# EasyEDA schematic 1-Schematic_SMUC2.json
TITLE: SMUC v2; REV: 1.0.1; Date: 2022-08-15; Sheet: 1/1; Drawn By: Romych; Company: zx-pk.ru
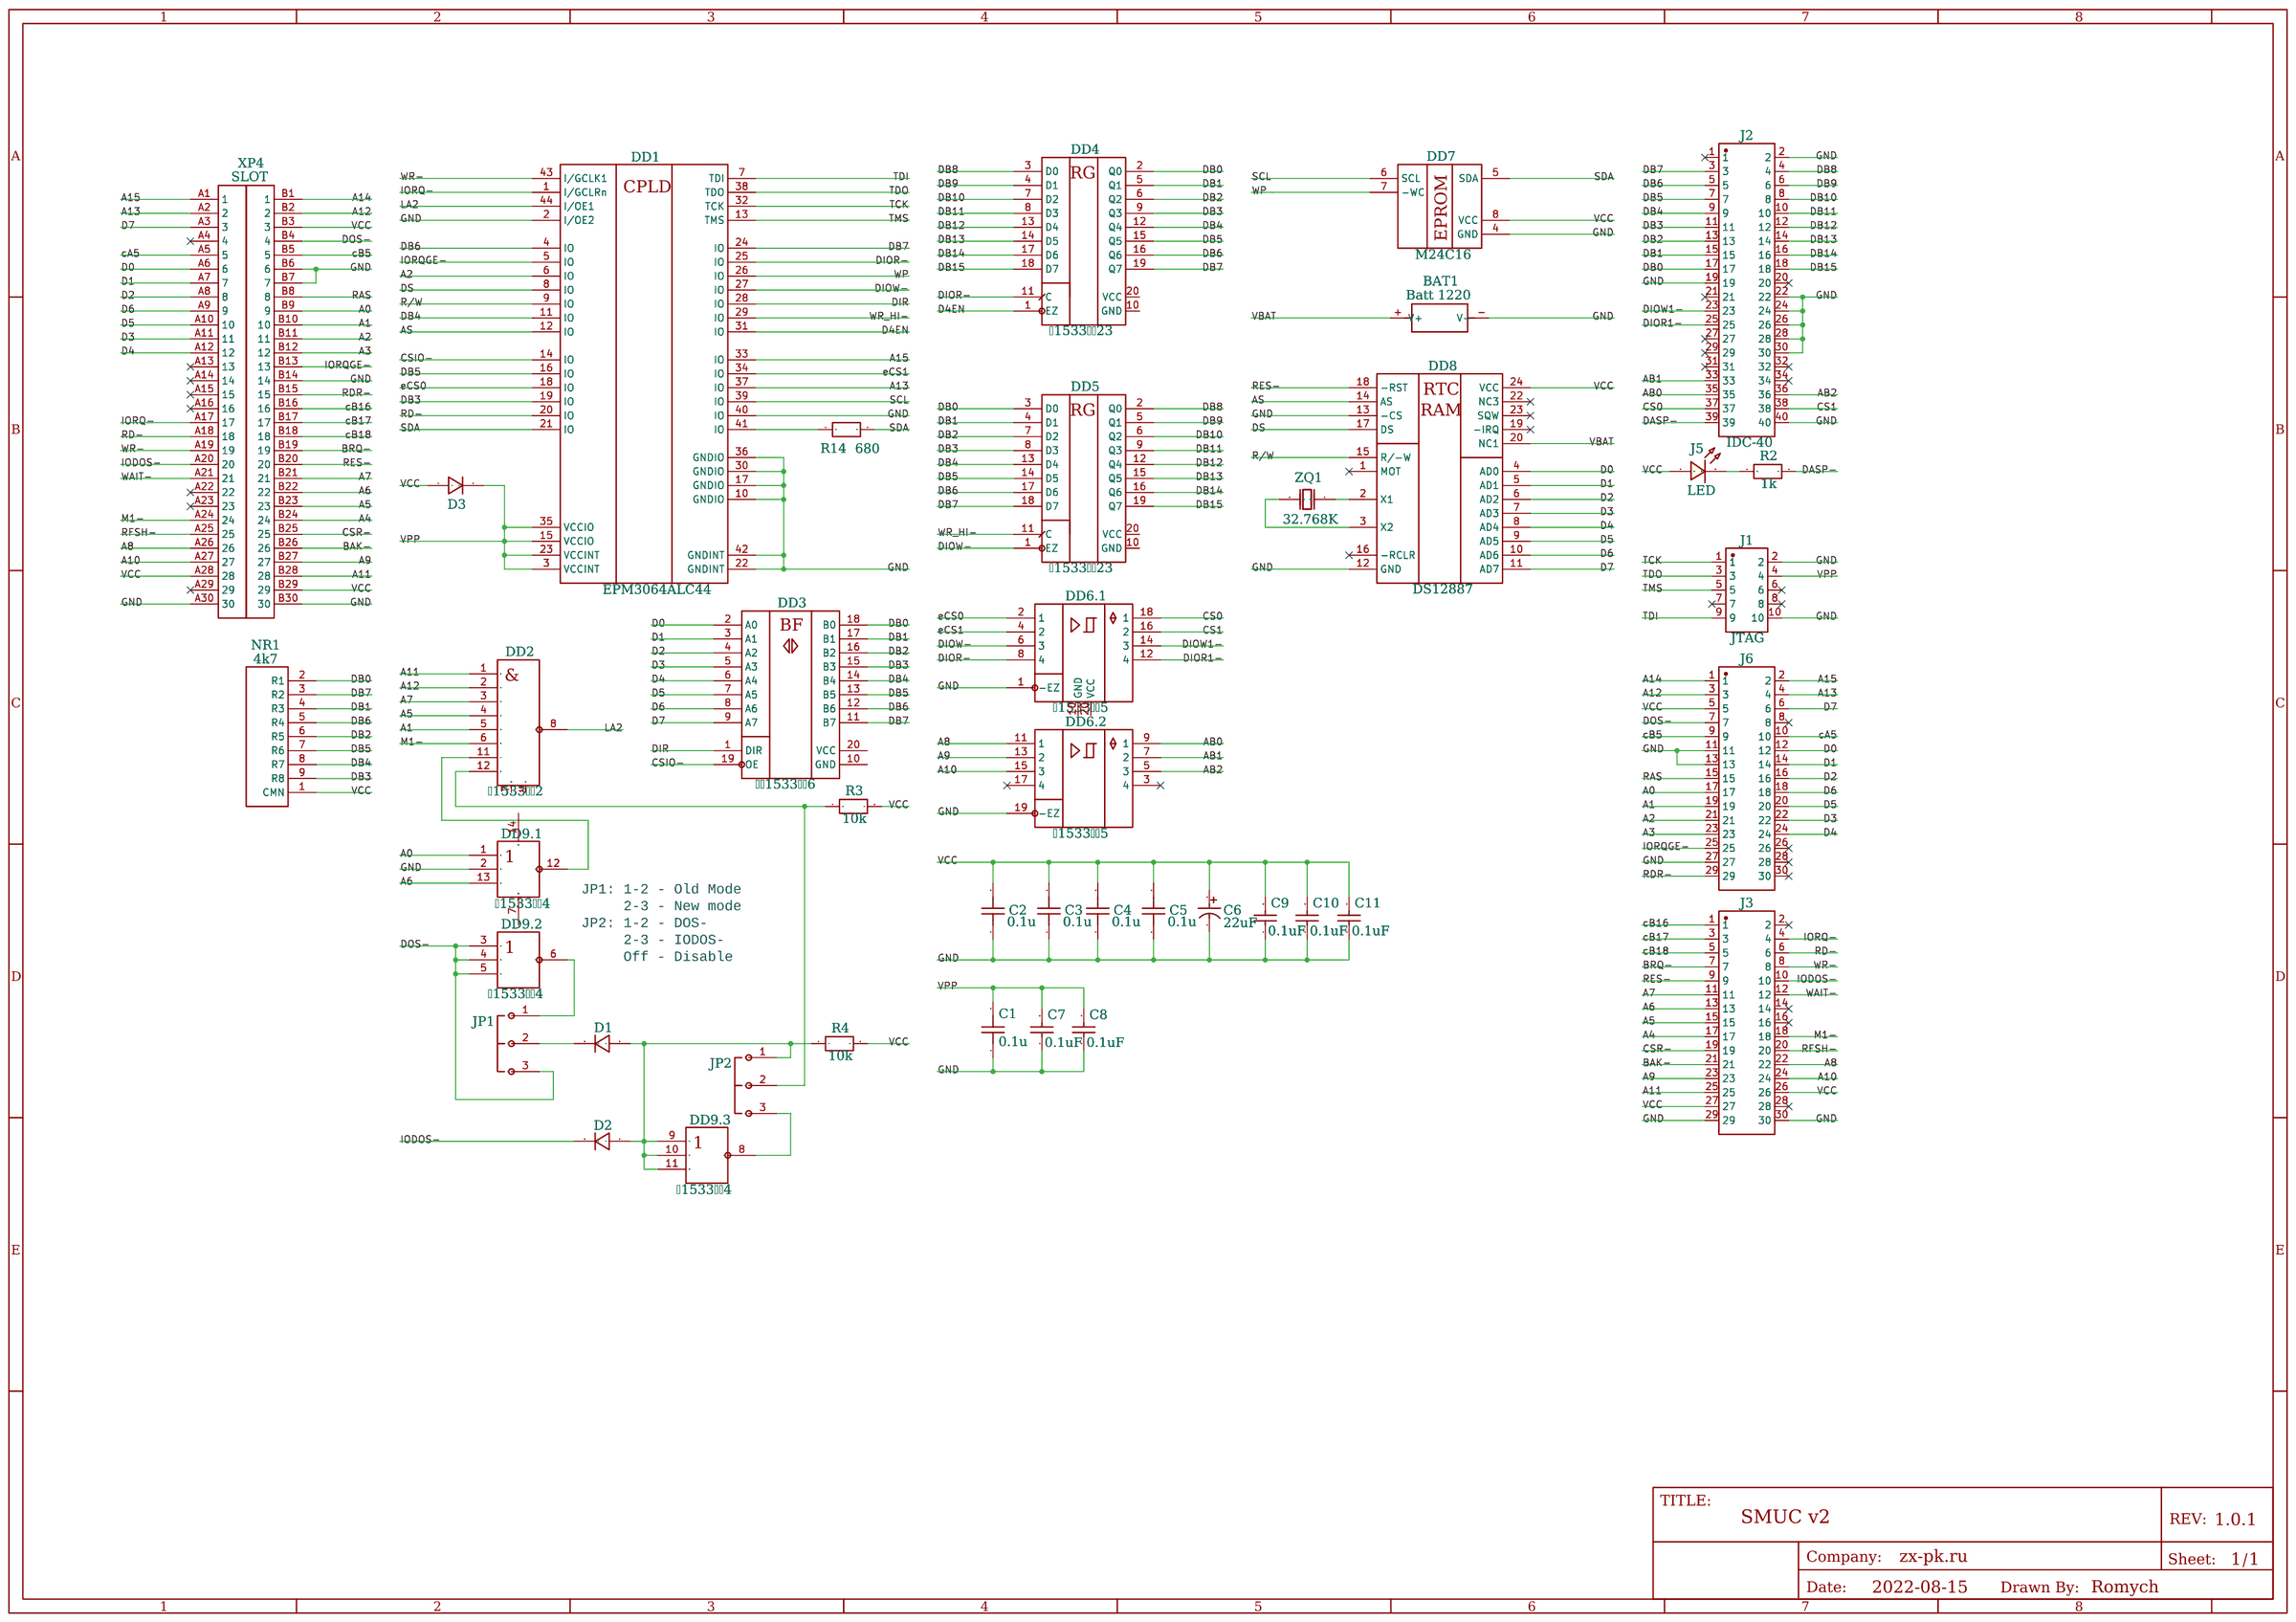
[diagram p0: schematic sheet]

## Parts
BAT1  Batt 1220  [BAT2P-SMD-16.4-CR1220]
C1  0.1u  [CAP-TH_L5.08]
C2  0.1u  [CAP-TH_L5.08]
C3  0.1u  [CAP-TH_L5.08]
C4  0.1u  [CAP-TH_L5.08]
C5  0.1u  [CAP-TH_L5.08]
C6  22uF  [CAP-TH_BD6.3-P2.50-D1.0-FD]
C7  0.1uF  [C0805]
C8  0.1uF  [C0805]
C9  0.1uF  [C0805]
C10  0.1uF  [C0805]
C11  0.1uF  [C0805]
D1  1N4148  [DIODE-TH_10.16]
D2  1N4148  [DIODE-TH_10.16]
D3  1N4148  [DIODE-TH_10.16]
DD1  EPM3064ALC44  [PLCC-44_TH_STD]
DD2  К1533ЛА2  [DIP-14_STD]
DD3  КР1533АП6  [DIP-20_STD]
DD4  К1533ИР23  [DIP-20_STD]
DD5  К1533ИР23  [DIP-20_STD]
DD6  К1533АП5  [DIP-20_STD]  (sections 1,2)
DD7  M24C16  [DIP-8_STD]
DD8  DS12887  [DIP-24_STD]
DD9  К1533ЛЕ4  [DIP-14_STD]  (sections 1,2,3)
J1  JTAG  [IDC-TH_10P-P2.54-V-R2-C5-S2.54]
J2  IDC-40  [CONN-TH_40P-P2.54_MTFD10-40B1]
J3  PM254-2-15-Z-8.5  [HDR-TH_30P-P2.54-V-F-R2-C15-S2.54-2]
J5  LED  [D-TH_L2.54]
J6  PM254-2-15-Z-8.5  [HDR-TH_30P-P2.54-V-F-R2-C15-S2.54-2]
JP1  Old/New  [HDR-TH_3P-P2.54-V-M]
JP2  DOS/IODOS  [HDR-TH_3P-P2.54-V-M]
NR1  4k7  [HDR-TH_9P-P2.54-V-F]
R2  1k  [R_0.125_7.62]
R3  10k  [R_0.125_7.62]
R4  10k  [R_0.125_7.62]
R14  680  [R_0.125_V_TH]
XP4  SLOT  [SL60-SLOT-2.54]
ZQ1  32.768K  [OSC-TH_5.08_H]

## Library data of the parts
BAT1 = SMD Battery Cell Holder Plastic: Manufacturer Part: ?
C1-C5 = CK45-R3AD152K-VRY: Supplier: LCSC; Supplier Part: C340608; Manufacturer: TDK; Contributor: LCSC
C6 = ECLJ0612220M101P00: Supplier: LCSC; Supplier Part: C156809; Manufacturer: Guangdong TOPAZ Elec Tech; Contributor: LCSC
C7-C11 = 0805CG0R5C500NT: Supplier: LCSC; Manufacturer: FH; Supplier Part: C1784
D1-D3 = 1N4148: Contributor: EasyEDA
DD1 = EPM3064ALC44: Contributor: romychs_4693
DD2 = К1533ЛА2: Supplier: chipdip; Contributor: Roman Boykov
DD3 = КР1533АП6: Supplier: chipdip; Contributor: romychs_4693
DD4 DD5 = К1533ИР23: Supplier: chipdip; link: TTL; Регистр; ИР23; Contributor: romychs_4693
DD6 = К1533АП5: Contributor: romychs_4693; subpart_no: 1
DD7 = M24C16: Contributor: Roman Boykov
DD8 = DS12887: Contributor: romychs_4693
DD9 = К1533ЛЕ4: Supplier: chipdip; Contributor: Roman Boykov; subpart_no: 1
J1 = X6521FV-2×05-C85D32: Supplier: LCSC; Supplier Part: C718231; Manufacturer: XKB Connectivity; Contributor: LCSC
J2 = MTFD10-40B1: Supplier: LCSC; Supplier Part: C376159; Manufacturer: MINTRON; Contributor: LCSC
J3 J6 = PM254-2-15-Z-8.5: Supplier: LCSC; Supplier Part: C2897416; Manufacturer: HCTL(华灿天禄); Contributor: LCSC; JLCPCB Part Class: Extended Part
J5 = LED-0603_R: Manufacturer: EVERLIGHT(台湾亿光); Manufacturer Part: 19-217/R6C-AL1M2VY/3T; Supplier Part: C72044; Supplier: LCSC; Contributor: LCEDA_01
JP1 JP2 = JUMPER-3PM-H: Contributor: romychs_4693
NR1 = НР-8: Supplier: chipdip; Contributor: Roman Boykov
R2-R4 R14 = RN 1/8W 470R F T/B A1: Supplier: LCSC; Supplier Part: C433478; Manufacturer: TyoHM; Contributor: LCSC
XP4 = PinHeader_2x30: Contributor: Roman Boykov
ZQ1 = CFS-20632768EZFB: Supplier: LCSC; Supplier Part: C326534; Manufacturer: CITIZEN; Contributor: LCSC

## Nets
GND: BAT1.-(V-) C1.1 C2.1 C3.1 C4.1 C5.1 C6.2 C7.1 C8.1 C9.1 C10.1 C11.1 DD1.2(I/OE2) DD1.10(GNDIO) DD1.17(GNDIO) DD1.22(GNDINT) DD1.30(GNDIO) DD1.36(GNDIO) DD1.40(IO) DD1.42(GNDINT) DD6.1(-EZ) DD6.19(-EZ) DD7.4(GND) DD8.12(GND) DD8.13(-CS) DD9.2(I2) J1.2 J1.10 J2.2 J2.19 J2.22 J2.24 J2.26 J2.28 J2.30 J2.40 J3.29 J3.30 J6.11 J6.13 J6.27 XP4.A30(30) XP4.B6(6) XP4.B7(7) XP4.B14(14) XP4.B30(30)
VBAT: BAT1.+(V+) DD8.20(NC1)
VCC: C2.2 C3.2 C4.2 C5.2 C6.1 C9.2 C10.2 C11.2 D3.1(A) DD7.8(VCC) DD8.24(VCC) J3.26 J3.27 J5.1 J6.5 NR1.1(CMN) R3.2 R4.2 XP4.A28(28) XP4.B3(3) XP4.B29(29)
A0: DD9.1(I1) J6.17 XP4.B9(9)
A1: DD2.5 J6.19 XP4.B10(10)
A2: DD1.6(IO) J6.21 XP4.B11(11)
A3: J6.23 XP4.B12(12)
A4: J3.17 XP4.B24(24)
A5: DD2.4 J3.15 XP4.B23(23)
A6: DD9.13(I3) J3.13 XP4.B22(22)
A7: DD2.3 J3.11 XP4.B21(21)
A8: DD6.11(1) J3.22 XP4.A26(26)
A9: DD6.13(2) J3.23 XP4.B27(27)
A10: DD6.15(3) J3.24 XP4.A27(27)
A11: DD2.1 J3.25 XP4.B28(28)
A12: DD2.2 J6.3 XP4.B2(2)
A13: DD1.37(IO) J6.4 XP4.A2(2)
A14: J6.1 XP4.B1(1)
A15: DD1.33(IO) J6.2 XP4.A1(1)
AB0: DD6.9(1) J2.35
AB1: DD6.7(2) J2.33
AB2: DD6.5(3) J2.36
AS: DD1.12(IO) DD8.14(AS)
BAK-: J3.21 XP4.B26(26)
BRQ-: J3.7 XP4.B19(19)
cA5: J6.10 XP4.A5(5)
cB5: J6.9 XP4.B5(5)
cB16: J3.1 XP4.B16(16)
cB17: J3.3 XP4.B17(17)
cB18: J3.5 XP4.B18(18)
CS0: DD6.18(1) J2.37
CS1: DD6.16(2) J2.38
CSIO-: DD1.14(IO) DD3.19(OE)
CSR-: J3.19 XP4.B25(25)
D0: DD3.2(A0) DD8.4(AD0) J6.12 XP4.A6(6)
D1: DD3.3(A1) DD8.5(AD1) J6.14 XP4.A7(7)
D2: DD3.4(A2) DD8.6(AD2) J6.16 XP4.A8(8)
D3: DD3.5(A3) DD8.7(AD3) J6.22 XP4.A11(11)
D4: DD3.6(A4) DD8.8(AD4) J6.24 XP4.A12(12)
D4EN: DD1.31(IO) DD4.1(EZ)
D5: DD3.7(A5) DD8.9(AD5) J6.20 XP4.A10(10)
D6: DD3.8(A6) DD8.10(AD6) J6.18 XP4.A9(9)
D7: DD3.9(A7) DD8.11(AD7) J6.6 XP4.A3(3)
DASP-: J2.39 R2.2
DB0: DD3.18(B0) DD4.2(Q0) DD5.3(D0) J2.17 NR1.2(R1)
DB1: DD3.17(B1) DD4.5(Q1) DD5.4(D1) J2.15 NR1.4(R3)
DB2: DD3.16(B2) DD4.6(Q2) DD5.7(D2) J2.13 NR1.6(R5)
DB3: DD1.19(IO) DD3.15(B3) DD4.9(Q3) DD5.8(D3) J2.11 NR1.9(R8)
DB4: DD1.11(IO) DD3.14(B4) DD4.12(Q4) DD5.13(D4) J2.9 NR1.8(R7)
DB5: DD1.16(IO) DD3.13(B5) DD4.15(Q5) DD5.14(D5) J2.7 NR1.7(R6)
DB6: DD1.4(IO) DD3.12(B6) DD4.16(Q6) DD5.17(D6) J2.5 NR1.5(R4)
DB7: DD1.24(IO) DD3.11(B7) DD4.19(Q7) DD5.18(D7) J2.3 NR1.3(R2)
DB8: DD4.3(D0) DD5.2(Q0) J2.4
DB9: DD4.4(D1) DD5.5(Q1) J2.6
DB10: DD4.7(D2) DD5.6(Q2) J2.8
DB11: DD4.8(D3) DD5.9(Q3) J2.10
DB12: DD4.13(D4) DD5.12(Q4) J2.12
DB13: DD4.14(D5) DD5.15(Q5) J2.14
DB14: DD4.17(D6) DD5.16(Q6) J2.16
DB15: DD4.18(D7) DD5.19(Q7) J2.18
DIOR1-: DD6.12(4) J2.25
DIOR-: DD1.25(IO) DD4.11(C) DD6.8(4)
DIOW1-: DD6.14(3) J2.23
DIOW-: DD1.27(IO) DD5.1(EZ) DD6.6(3)
DIR: DD1.28(IO) DD3.1(DIR)
DOS-: DD9.3(I1) DD9.4(I2) DD9.5(I3) J6.7 JP1.3 XP4.B4(4)
DS: DD1.8(IO) DD8.17(DS)
eCS0: DD1.18(IO) DD6.2(1)
eCS1: DD1.34(IO) DD6.4(2)
IODOS-: D2.2(K) J3.10 XP4.A20(20)
IORQ-: DD1.1(I/GCLRn) J3.4 XP4.A17(17)
IORQGE-: DD1.5(IO) J6.25 XP4.B13(13)
LA2: DD1.44(I/OE1) DD2.8
M1-: DD2.6 J3.18 XP4.A24(24)
R/W: DD1.9(IO) DD8.15(R/-W)
RAS: J6.15 XP4.B8(8)
RD-: DD1.20(IO) J3.6 XP4.A18(18)
RDR-: J6.29 XP4.B15(15)
RES-: DD8.18(-RST) J3.9 XP4.B20(20)
RFSH-: J3.20 XP4.A25(25)
SCL: DD1.39(IO) DD7.6(SCL)
SDA: DD1.21(IO) DD7.5(SDA) R14.2
TCK: DD1.32(TCK) J1.1
TDI: DD1.7(TDI) J1.9
TDO: DD1.38(TDO) J1.3
TMS: DD1.13(TMS) J1.5
VPP: C1.2 C7.2 C8.2 D3.2(K) DD1.3(VCCINT) DD1.15(VCCIO) DD1.23(VCCINT) DD1.35(VCCIO) J1.4
WAIT-: J3.12 XP4.A21(21)
WP: DD1.26(IO) DD7.7(-WC)
WR-: DD1.43(I/GCLK1) J3.8 XP4.A19(19)
WR_HI-: DD1.29(IO) DD5.11(C)
Net-(D1-1): D1.1(A) D2.1(A) DD9.9(I1) DD9.10(I2) DD9.11(I3) JP2.1 R4.1
Net-(D1-2): D1.2(K) JP1.2
Net-(DD1-41): DD1.41(IO) R14.1
Net-(DD2-11): DD2.11(7) DD9.12(O)
Net-(DD2-12): DD2.12(8) JP2.2 R3.1
Net-(DD8-2): DD8.2(X1) ZQ1.2(OSC2)
Net-(DD8-3): DD8.3(X2) ZQ1.1(OSC1)
Net-(DD9.2-6): DD9.6(O) JP1.1
Net-(DD9.3-8): DD9.8(O) JP2.3
Net-(J5-2): J5.2 R2.1

Not connected (* = marked no-connect by the designer): DD2 7(GND) 14(VCC); DD3 10(GND) 20(VCC); DD4 10(GND) 20(VCC); DD5 10(GND) 20(VCC); DD6 3(4)* 10(GND) 17(4)* 20(VCC); DD8 1(MOT)* 16(-RCLR)* 19(-IRQ)* 22(NC3)* 23(SQW)*; DD9 7(GND) 14(VCC); J1 6* 7* 8*; J2 1* 20* 21* 27* 29* 31* 32* 34*; J3 2* 14* 16* 28*; J6 8* 26* 28* 30*; XP4 A4(4)* A13(13)* A14(14)* A15(15)* A16(16)* A22(22)* A23(23)* A29(29)*

## Notes on the sheet
- JP1: 1-2 - Old Mode
       2-3 - New mode
  JP2: 1-2 - DOS-
       2-3 - IODOS-
       Off - Disable
